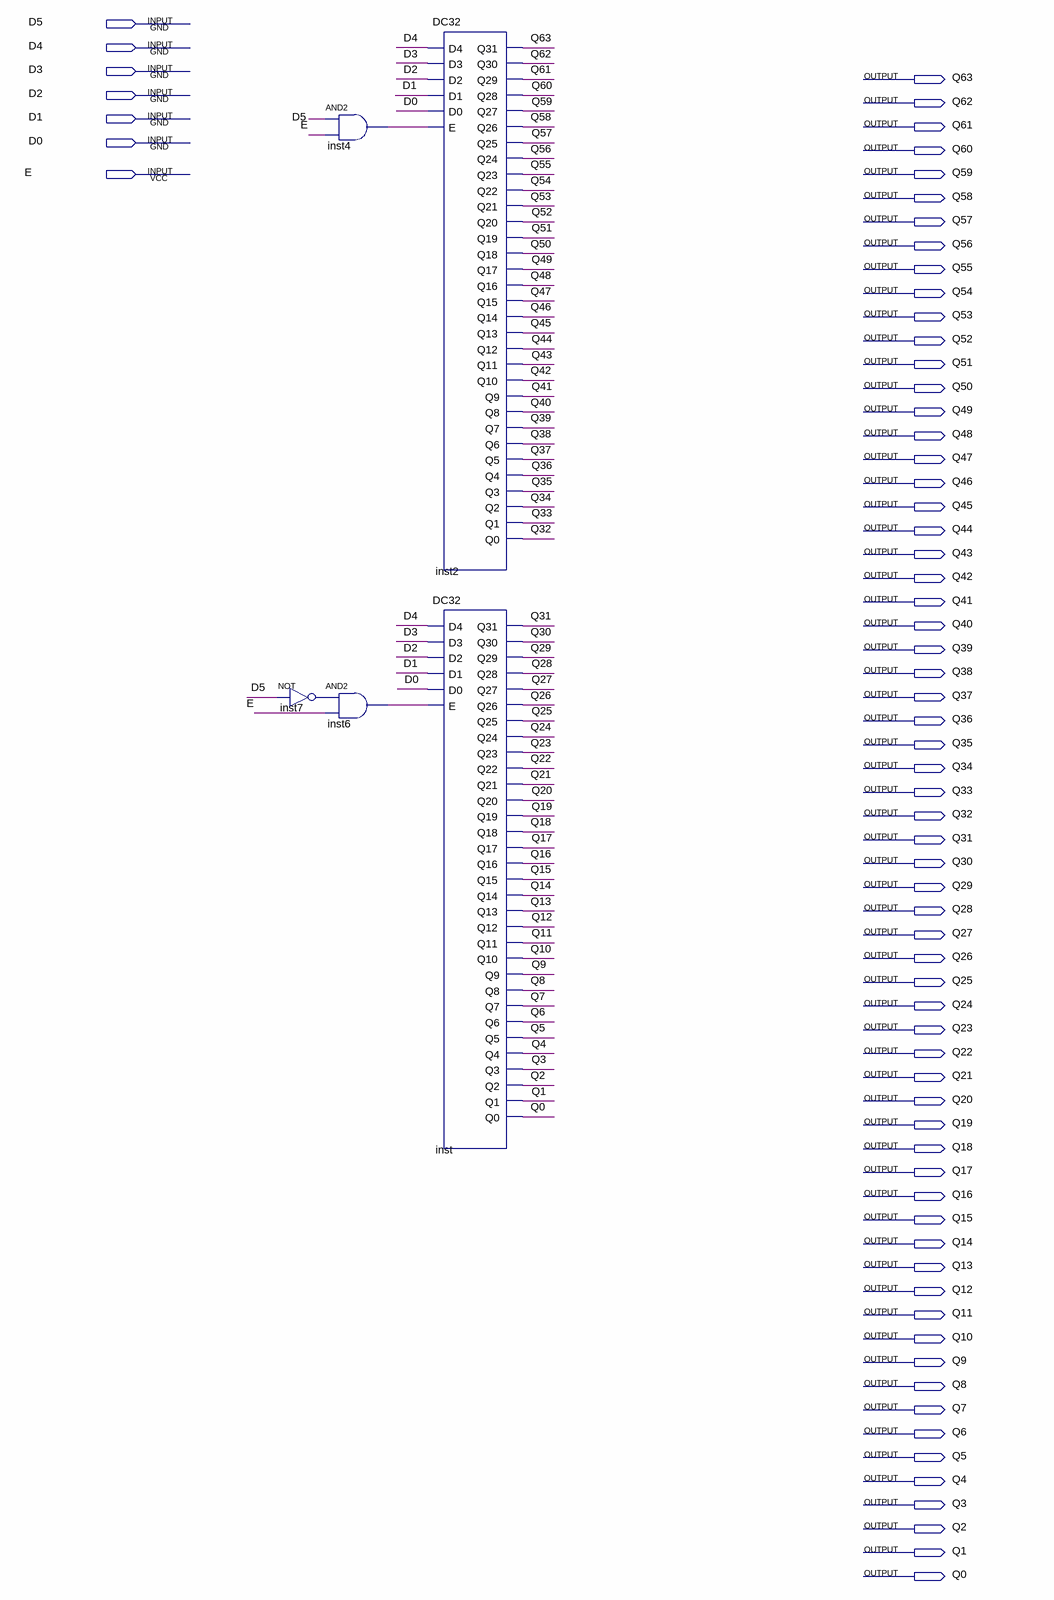
[diagram p0: schematic sheet]
// Quartus schematic DC64.bdf as structural Verilog: 5 symbols, 71 pins
module DC64 (
  input  D5,
  input  D4,
  input  D3,
  input  D2,
  input  D1,
  input  D0,
  input  E,
  output Q63,
  output Q62,
  output Q61,
  output Q60,
  output Q59,
  output Q58,
  output Q57,
  output Q56,
  output Q55,
  output Q54,
  output Q53,
  output Q52,
  output Q51,
  output Q50,
  output Q49,
  output Q48,
  output Q47,
  output Q46,
  output Q45,
  output Q44,
  output Q43,
  output Q42,
  output Q41,
  output Q40,
  output Q39,
  output Q38,
  output Q37,
  output Q36,
  output Q35,
  output Q34,
  output Q33,
  output Q32,
  output Q31,
  output Q30,
  output Q29,
  output Q28,
  output Q27,
  output Q26,
  output Q25,
  output Q24,
  output Q23,
  output Q22,
  output Q21,
  output Q20,
  output Q19,
  output Q18,
  output Q17,
  output Q16,
  output Q15,
  output Q14,
  output Q13,
  output Q12,
  output Q11,
  output Q10,
  output Q9,
  output Q8,
  output Q7,
  output Q6,
  output Q5,
  output Q4,
  output Q3,
  output Q2,
  output Q1,
  output Q0
);

  wire inst4_out, inst6_out, inst7_out;

  not inst7 (inst7_out, D5);
  and inst4 (inst4_out, D5, E);
  and inst6 (inst6_out, inst7_out, E);
  DC32 inst2 (
    .D4(D4), .D3(D3), .D2(D2), .D1(D1), .D0(D0), .E(inst4_out), .Q31(Q63), .Q30(Q62), .Q29(Q61), .Q28(Q60),
    .Q27(Q59), .Q26(Q58), .Q25(Q57), .Q24(Q56), .Q23(Q55), .Q22(Q54), .Q21(Q53), .Q20(Q52), .Q19(Q51),
    .Q18(Q50), .Q17(Q49), .Q16(Q48), .Q15(Q47), .Q14(Q46), .Q13(Q45), .Q12(Q44), .Q11(Q43), .Q10(Q42),
    .Q9(Q41), .Q8(Q40), .Q7(Q39), .Q6(Q38), .Q5(Q37), .Q4(Q36), .Q3(Q35), .Q2(Q34), .Q1(Q33), .Q0(Q32));
  DC32 inst (
    .D4(D4), .D3(D3), .D2(D2), .D1(D1), .D0(D0), .E(inst6_out), .Q31(Q31), .Q30(Q30), .Q29(Q29), .Q28(Q28),
    .Q27(Q27), .Q26(Q26), .Q25(Q25), .Q24(Q24), .Q23(Q23), .Q22(Q22), .Q21(Q21), .Q20(Q20), .Q19(Q19),
    .Q18(Q18), .Q17(Q17), .Q16(Q16), .Q15(Q15), .Q14(Q14), .Q13(Q13), .Q12(Q12), .Q11(Q11), .Q10(Q10),
    .Q9(Q9), .Q8(Q8), .Q7(Q7), .Q6(Q6), .Q5(Q5), .Q4(Q4), .Q3(Q3), .Q2(Q2), .Q1(Q1), .Q0(Q0));
endmodule
